# EAGLE schematic Keyboard65 (EAGLE 9.6.1)
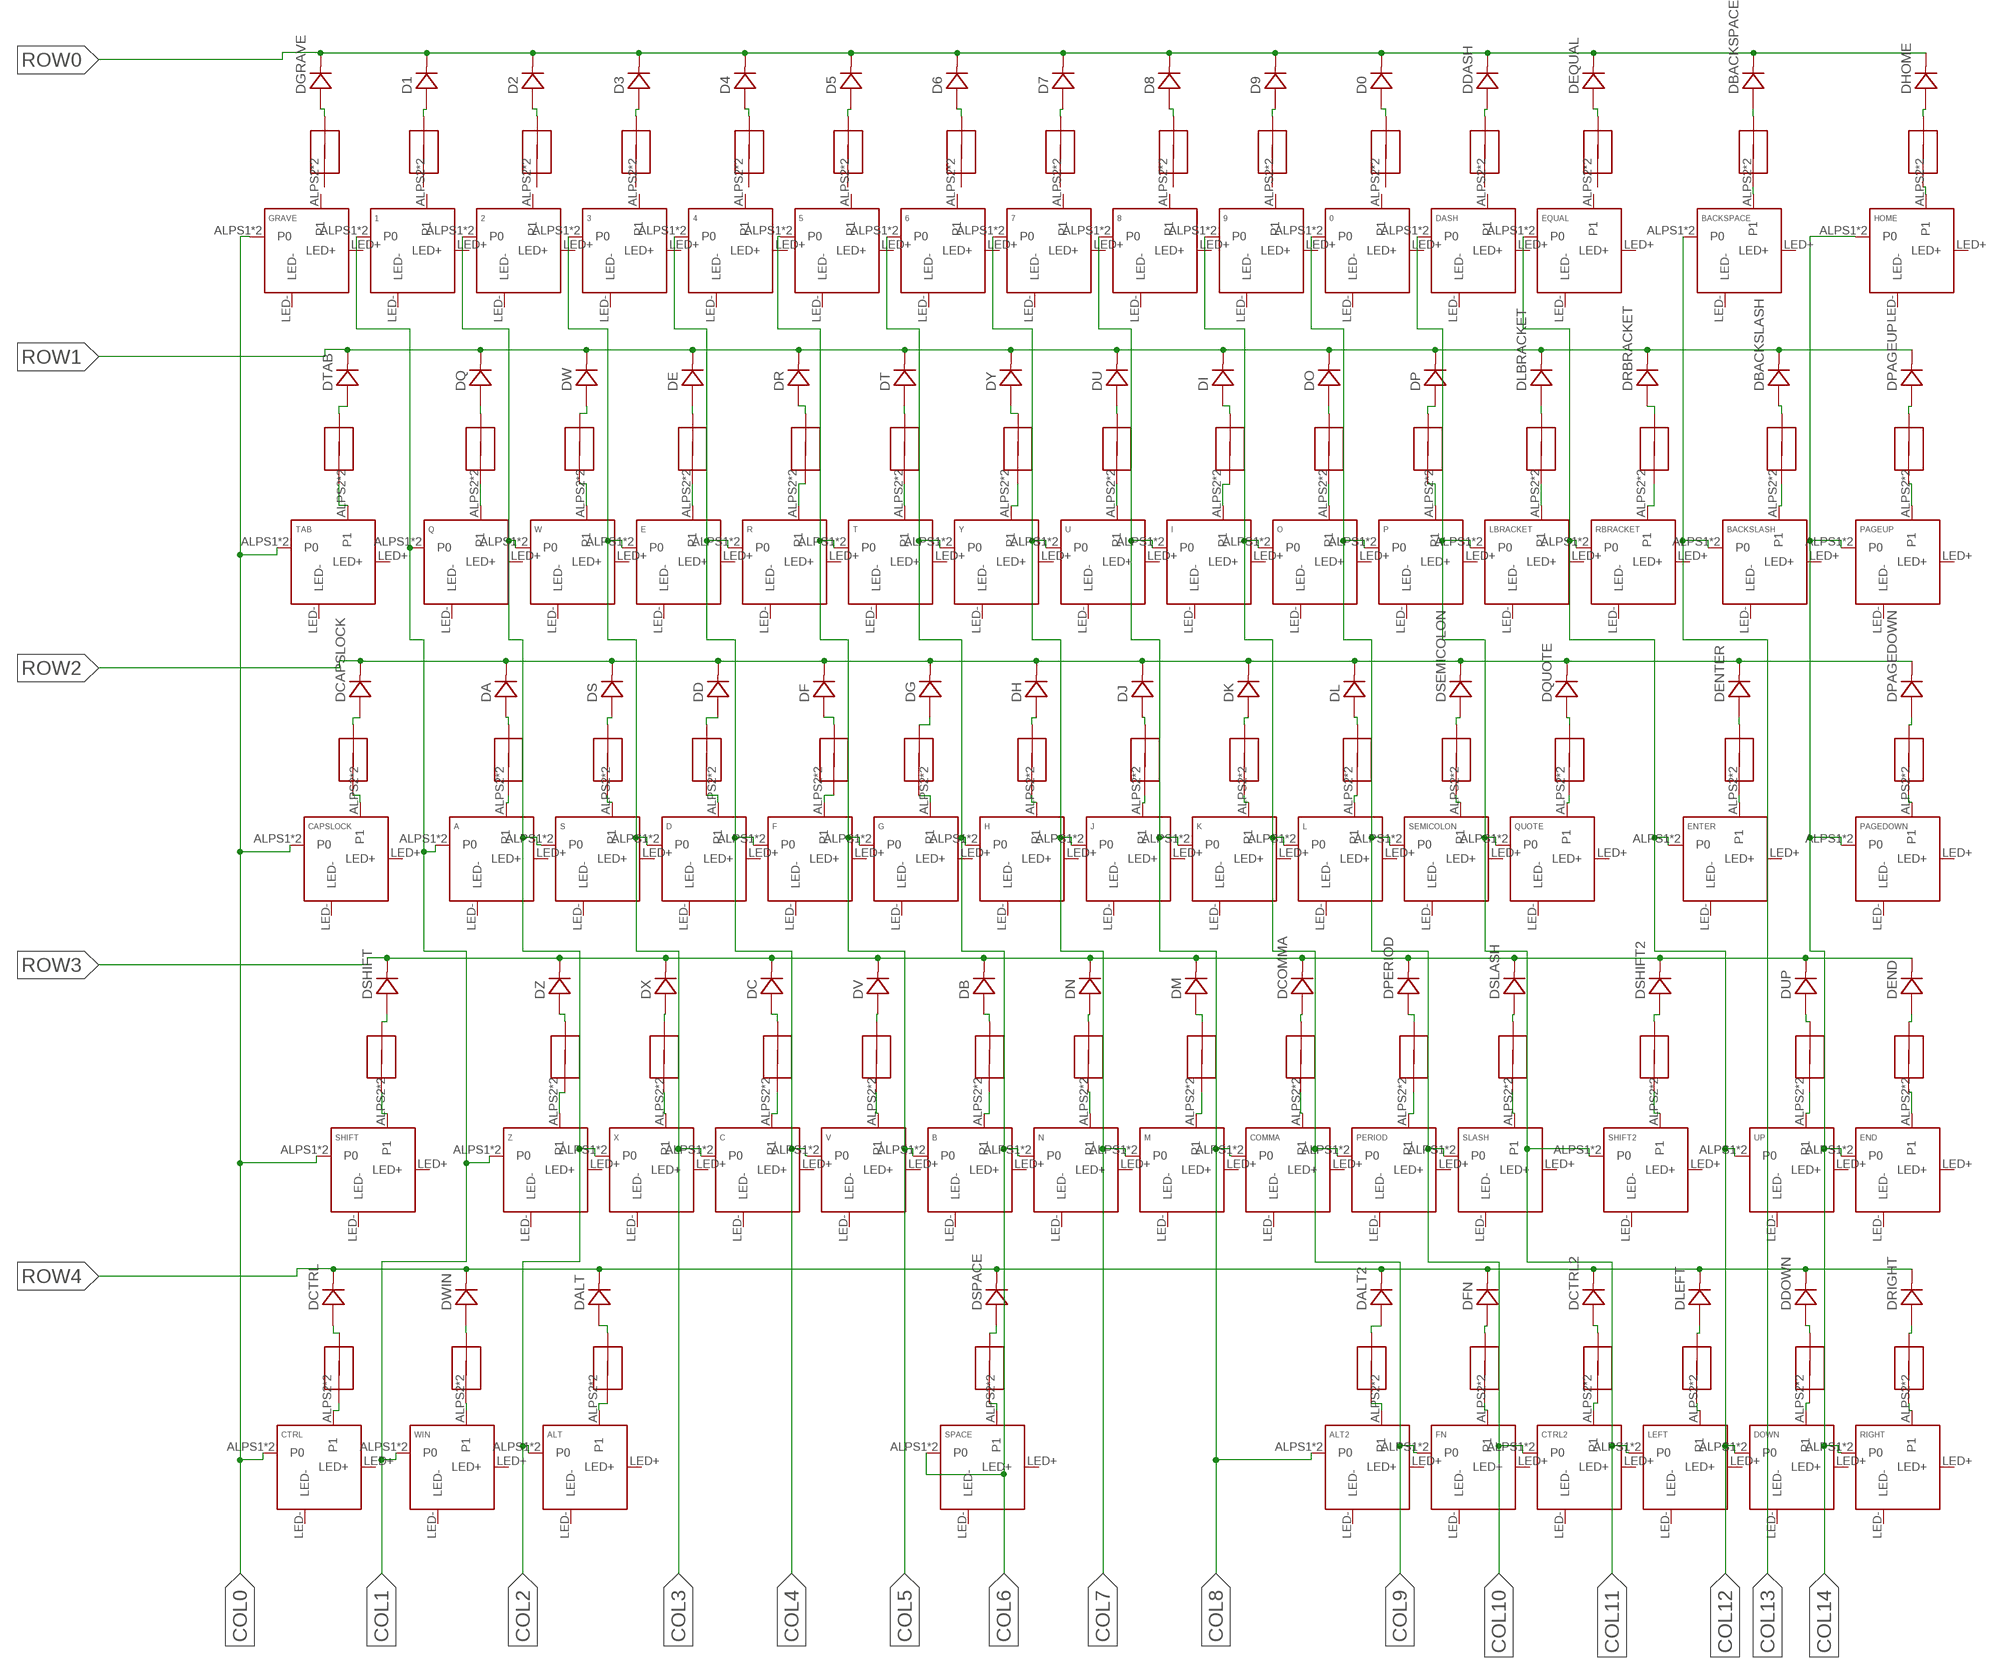
[diagram p0: schematic, sheet 1, part 1 of 2]
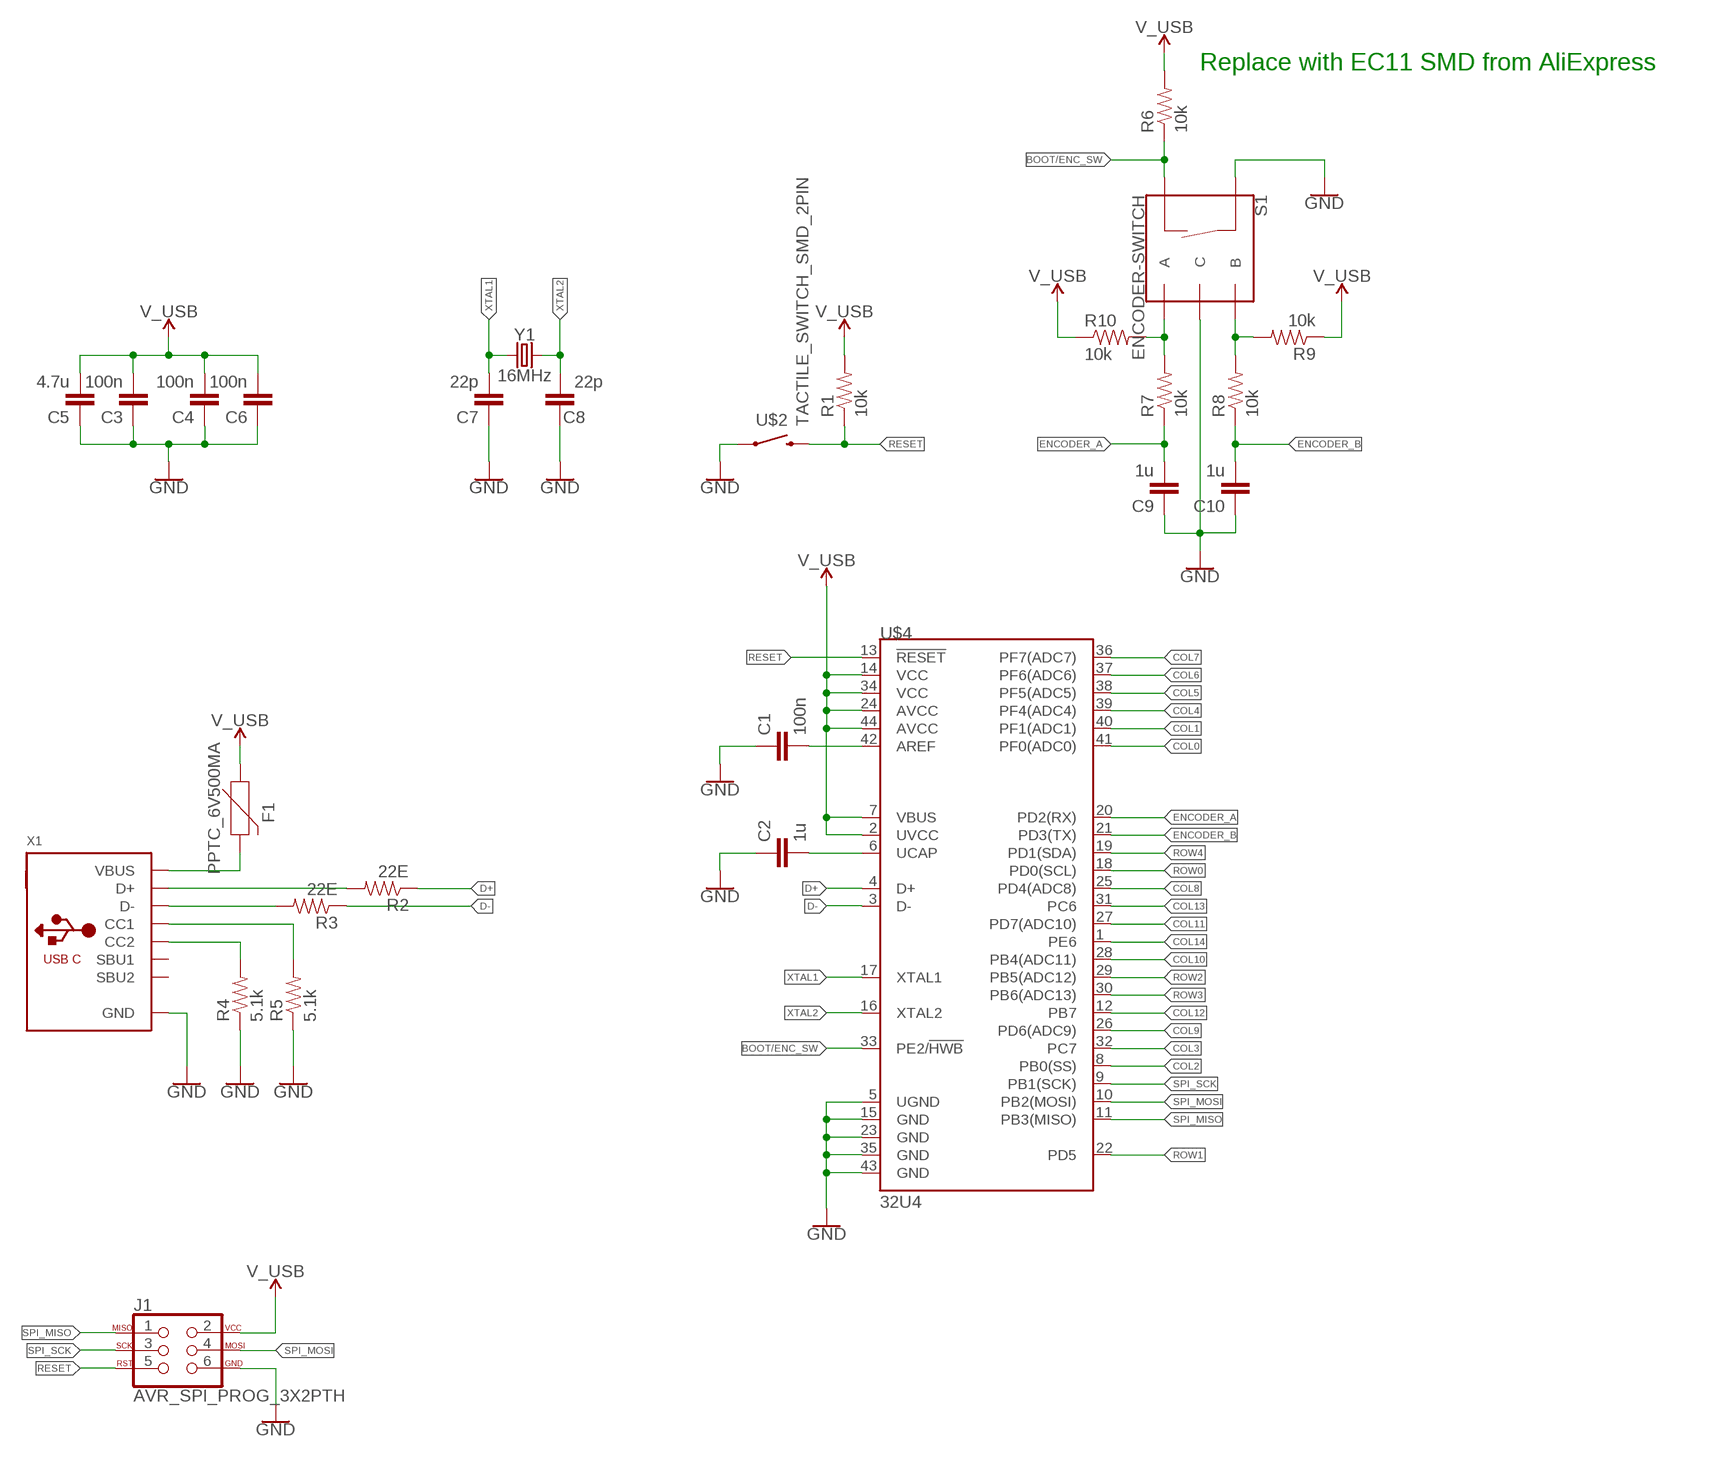
[diagram p1: schematic, sheet 1, part 2 of 2]

## Parts
0  KEYSWITCH-LED-ALPSMX-1U-LED  [ALPSMX-1U-LED]
1  KEYSWITCH-LED-ALPSMX-1U-LED  [ALPSMX-1U-LED]
2  KEYSWITCH-LED-ALPSMX-1U-LED  [ALPSMX-1U-LED]
3  KEYSWITCH-LED-ALPSMX-1U-LED  [ALPSMX-1U-LED]
4  KEYSWITCH-LED-ALPSMX-1U-LED  [ALPSMX-1U-LED]
5  KEYSWITCH-LED-ALPSMX-1U-LED  [ALPSMX-1U-LED]
6  KEYSWITCH-LED-ALPSMX-1U-LED  [ALPSMX-1U-LED]
7  KEYSWITCH-LED-ALPSMX-1U-LED  [ALPSMX-1U-LED]
8  KEYSWITCH-LED-ALPSMX-1U-LED  [ALPSMX-1U-LED]
9  KEYSWITCH-LED-ALPSMX-1U-LED  [ALPSMX-1U-LED]
A  KEYSWITCH-LED-ALPSMX-1U-LED  [ALPSMX-1U-LED]
ALT  KEYSWITCH-LED-ALPSMX-1U-LED  [ALPSMX-1U-LED]
ALT2  KEYSWITCH-LED-ALPSMX-1U-LED  [ALPSMX-1U-LED]
B  KEYSWITCH-LED-ALPSMX-1U-LED  [ALPSMX-1U-LED]
BACKSLASH  KEYSWITCH-LED-ALPSMX-1U-LED  [ALPSMX-1U-LED]
BACKSPACE  KEYSWITCH-LED-ALPSMX-2U-LED  [ALPSMX-2U-LED]
C  KEYSWITCH-LED-ALPSMX-1U-LED  [ALPSMX-1U-LED]
C1  100n  CAP0805  [0805]
C2  1u  CAP0805  [0805]
C3  100n  CAP0805  [0805]
C4  100n  CAP0805  [0805]
C5  4.7u  CAP0805  [0805]
C6  100n  CAP0805  [0805]
C7  22p  CAP0805  [0805]
C8  22p  CAP0805  [0805]
C9  1u  CAP0805  [0805]
C10  1u  CAP0805  [0805]
CAPSLOCK  KEYSWITCH-LED-ALPSMX-1U-LED  [ALPSMX-1U-LED]
COMMA  KEYSWITCH-LED-ALPSMX-1U-LED  [ALPSMX-1U-LED]
CTRL  KEYSWITCH-LED-ALPSMX-1U-LED  [ALPSMX-1U-LED]
CTRL2  KEYSWITCH-LED-ALPSMX-1U-LED  [ALPSMX-1U-LED]
D  KEYSWITCH-LED-ALPSMX-1U-LED  [ALPSMX-1U-LED]
D0  DIODE-SOD-123  [SOD-123]
D1  DIODE-SOD-123  [SOD-123]
D2  DIODE-SOD-123  [SOD-123]
D3  DIODE-SOD-123  [SOD-123]
D4  DIODE-SOD-123  [SOD-123]
D5  DIODE-SOD-123  [SOD-123]
D6  DIODE-SOD-123  [SOD-123]
D7  DIODE-SOD-123  [SOD-123]
D8  DIODE-SOD-123  [SOD-123]
D9  DIODE-SOD-123  [SOD-123]
DA  DIODE-SOD-123  [SOD-123]
DALT  DIODE-SOD-123  [SOD-123]
DALT2  DIODE-SOD-123  [SOD-123]
DASH  KEYSWITCH-LED-ALPSMX-1U-LED  [ALPSMX-1U-LED]
DB  DIODE-SOD-123  [SOD-123]
DBACKSLASH  DIODE-SOD-123  [SOD-123]
DBACKSPACE  DIODE-SOD-123  [SOD-123]
DC  DIODE-SOD-123  [SOD-123]
DCAPSLOCK  DIODE-SOD-123  [SOD-123]
DCOMMA  DIODE-SOD-123  [SOD-123]
DCTRL  DIODE-SOD-123  [SOD-123]
DCTRL2  DIODE-SOD-123  [SOD-123]
DD  DIODE-SOD-123  [SOD-123]
DDASH  DIODE-SOD-123  [SOD-123]
DDOWN  DIODE-SOD-123  [SOD-123]
DE  DIODE-SOD-123  [SOD-123]
DEND  DIODE-SOD-123  [SOD-123]
DENTER  DIODE-SOD-123  [SOD-123]
DEQUAL  DIODE-SOD-123  [SOD-123]
DF  DIODE-SOD-123  [SOD-123]
DFN  DIODE-SOD-123  [SOD-123]
DG  DIODE-SOD-123  [SOD-123]
DGRAVE  DIODE-SOD-123  [SOD-123]
DH  DIODE-SOD-123  [SOD-123]
DHOME  DIODE-SOD-123  [SOD-123]
DI  DIODE-SOD-123  [SOD-123]
DJ  DIODE-SOD-123  [SOD-123]
DK  DIODE-SOD-123  [SOD-123]
DL  DIODE-SOD-123  [SOD-123]
DLBRACKET  DIODE-SOD-123  [SOD-123]
DLEFT  DIODE-SOD-123  [SOD-123]
DM  DIODE-SOD-123  [SOD-123]
DN  DIODE-SOD-123  [SOD-123]
DO  DIODE-SOD-123  [SOD-123]
DOWN  KEYSWITCH-LED-ALPSMX-1U-LED  [ALPSMX-1U-LED]
DP  DIODE-SOD-123  [SOD-123]
DPAGEDOWN  DIODE-SOD-123  [SOD-123]
DPAGEUP  DIODE-SOD-123  [SOD-123]
DPERIOD  DIODE-SOD-123  [SOD-123]
DQ  DIODE-SOD-123  [SOD-123]
DQUOTE  DIODE-SOD-123  [SOD-123]
DR  DIODE-SOD-123  [SOD-123]
DRBRACKET  DIODE-SOD-123  [SOD-123]
DRIGHT  DIODE-SOD-123  [SOD-123]
DS  DIODE-SOD-123  [SOD-123]
DSEMICOLON  DIODE-SOD-123  [SOD-123]
DSHIFT  DIODE-SOD-123  [SOD-123]
DSHIFT2  DIODE-SOD-123  [SOD-123]
DSLASH  DIODE-SOD-123  [SOD-123]
DSPACE  DIODE-SOD-123  [SOD-123]
DT  DIODE-SOD-123  [SOD-123]
DTAB  DIODE-SOD-123  [SOD-123]
DU  DIODE-SOD-123  [SOD-123]
DUP  DIODE-SOD-123  [SOD-123]
DV  DIODE-SOD-123  [SOD-123]
DW  DIODE-SOD-123  [SOD-123]
DWIN  DIODE-SOD-123  [SOD-123]
DX  DIODE-SOD-123  [SOD-123]
DY  DIODE-SOD-123  [SOD-123]
DZ  DIODE-SOD-123  [SOD-123]
E  KEYSWITCH-LED-ALPSMX-1U-LED  [ALPSMX-1U-LED]
END  KEYSWITCH-LED-ALPSMX-1U-LED  [ALPSMX-1U-LED]
ENTER  KEYSWITCH-LED-ALPSMX-2U-LED  [ALPSMX-2U-LED]
EQUAL  KEYSWITCH-LED-ALPSMX-1U-LED  [ALPSMX-1U-LED]
F  KEYSWITCH-LED-ALPSMX-1U-LED  [ALPSMX-1U-LED]
F1  PPTC_6V500MA  [0805]
FN  KEYSWITCH-LED-ALPSMX-1U-LED  [ALPSMX-1U-LED]
G  KEYSWITCH-LED-ALPSMX-1U-LED  [ALPSMX-1U-LED]
GRAVE  KEYSWITCH-LED-ALPSMX-1U-LED  [ALPSMX-1U-LED]
H  KEYSWITCH-LED-ALPSMX-1U-LED  [ALPSMX-1U-LED]
HOME  KEYSWITCH-LED-ALPSMX-1U-LED  [ALPSMX-1U-LED]
I  KEYSWITCH-LED-ALPSMX-1U-LED  [ALPSMX-1U-LED]
J  KEYSWITCH-LED-ALPSMX-1U-LED  [ALPSMX-1U-LED]
J1  AVR_SPI_PROG_3X2PTH  [2X3]
K  KEYSWITCH-LED-ALPSMX-1U-LED  [ALPSMX-1U-LED]
L  KEYSWITCH-LED-ALPSMX-1U-LED  [ALPSMX-1U-LED]
LBRACKET  KEYSWITCH-LED-ALPSMX-1U-LED  [ALPSMX-1U-LED]
LEFT  KEYSWITCH-LED-ALPSMX-1U-LED  [ALPSMX-1U-LED]
M  KEYSWITCH-LED-ALPSMX-1U-LED  [ALPSMX-1U-LED]
N  KEYSWITCH-LED-ALPSMX-1U-LED  [ALPSMX-1U-LED]
O  KEYSWITCH-LED-ALPSMX-1U-LED  [ALPSMX-1U-LED]
P  KEYSWITCH-LED-ALPSMX-1U-LED  [ALPSMX-1U-LED]
PAGEDOWN  KEYSWITCH-LED-ALPSMX-1U-LED  [ALPSMX-1U-LED]
PAGEUP  KEYSWITCH-LED-ALPSMX-1U-LED  [ALPSMX-1U-LED]
PERIOD  KEYSWITCH-LED-ALPSMX-1U-LED  [ALPSMX-1U-LED]
Q  KEYSWITCH-LED-ALPSMX-1U-LED  [ALPSMX-1U-LED]
QUOTE  KEYSWITCH-LED-ALPSMX-1U-LED  [ALPSMX-1U-LED]
R  KEYSWITCH-LED-ALPSMX-1U-LED  [ALPSMX-1U-LED]
R1  10k  RESISTOR  [0805]
R2  22E  RESISTOR  [0805]
R3  22E  RESISTOR  [0805]
R4  5.1k  RESISTOR  [0805]
R5  5.1k  RESISTOR  [0805]
R6  10k  RESISTOR  [0805]
R7  10k  RESISTOR  [0805]
R8  10k  RESISTOR  [0805]
R9  10k  RESISTOR  [0805]
R10  10k  RESISTOR  [0805]
RBRACKET  KEYSWITCH-LED-ALPSMX-1U-LED  [ALPSMX-1U-LED]
RIGHT  KEYSWITCH-LED-ALPSMX-1U-LED  [ALPSMX-1U-LED]
S  KEYSWITCH-LED-ALPSMX-1U-LED  [ALPSMX-1U-LED]
S1  ENCODER-SWITCH  [ROTARY_ENC_PLAIN]
SEMICOLON  KEYSWITCH-LED-ALPSMX-1U-LED  [ALPSMX-1U-LED]
SHIFT  KEYSWITCH-LED-ALPSMX-2U-LED  [ALPSMX-2U-LED]
SHIFT2  KEYSWITCH-LED-ALPSMX-1U-LED  [ALPSMX-1U-LED]
SLASH  KEYSWITCH-LED-ALPSMX-1U-LED  [ALPSMX-1U-LED]
SPACE  KEYSWITCH-LED-ALPSMX-6.25U-LED  [ALPSMX-6.25U-LED]
T  KEYSWITCH-LED-ALPSMX-1U-LED  [ALPSMX-1U-LED]
TAB  KEYSWITCH-LED-ALPSMX-1U-LED  [ALPSMX-1U-LED]
U  KEYSWITCH-LED-ALPSMX-1U-LED  [ALPSMX-1U-LED]
U$1  KBD-SEPERATOR  [KBD-SEPERATOR]
U$2  TACTILE_SWITCH_SMD_2PIN  [TACTILE_SWITCH_SMD_2PIN]
U$3  KBD-SEPERATOR  [KBD-SEPERATOR]
U$4  32U4  ATMEGA32U4QFN  [QFN-44]
U$5  KBD-SEPERATOR  [KBD-SEPERATOR]
U$6  KBD-SEPERATOR  [KBD-SEPERATOR]
U$7  KBD-SEPERATOR  [KBD-SEPERATOR]
U$8  KBD-SEPERATOR  [KBD-SEPERATOR]
U$9  KBD-SEPERATOR  [KBD-SEPERATOR]
U$10  KBD-SEPERATOR  [KBD-SEPERATOR]
U$11  KBD-SEPERATOR  [KBD-SEPERATOR]
U$12  KBD-SEPERATOR  [KBD-SEPERATOR]
U$13  KBD-SEPERATOR  [KBD-SEPERATOR]
U$14  KBD-SEPERATOR  [KBD-SEPERATOR]
U$15  KBD-SEPERATOR  [KBD-SEPERATOR]
U$16  KBD-SEPERATOR  [KBD-SEPERATOR]
U$17  KBD-SEPERATOR  [KBD-SEPERATOR]
U$18  KBD-SEPERATOR  [KBD-SEPERATOR]
U$19  KBD-SEPERATOR  [KBD-SEPERATOR]
U$20  KBD-SEPERATOR  [KBD-SEPERATOR]
U$21  KBD-SEPERATOR  [KBD-SEPERATOR]
U$22  KBD-SEPERATOR  [KBD-SEPERATOR]
U$23  KBD-SEPERATOR  [KBD-SEPERATOR]
U$24  KBD-SEPERATOR  [KBD-SEPERATOR]
U$25  KBD-SEPERATOR  [KBD-SEPERATOR]
U$26  KBD-SEPERATOR  [KBD-SEPERATOR]
U$27  KBD-SEPERATOR  [KBD-SEPERATOR]
U$28  KBD-SEPERATOR  [KBD-SEPERATOR]
U$29  KBD-SEPERATOR  [KBD-SEPERATOR]
U$30  KBD-SEPERATOR  [KBD-SEPERATOR]
U$31  KBD-SEPERATOR  [KBD-SEPERATOR]
U$32  KBD-SEPERATOR  [KBD-SEPERATOR]
U$33  KBD-SEPERATOR  [KBD-SEPERATOR]
U$34  KBD-SEPERATOR  [KBD-SEPERATOR]
U$35  KBD-SEPERATOR  [KBD-SEPERATOR]
U$36  KBD-SEPERATOR  [KBD-SEPERATOR]
U$37  KBD-SEPERATOR  [KBD-SEPERATOR]
U$38  KBD-SEPERATOR  [KBD-SEPERATOR]
U$39  KBD-SEPERATOR  [KBD-SEPERATOR]
U$40  KBD-SEPERATOR  [KBD-SEPERATOR]
U$41  KBD-SEPERATOR  [KBD-SEPERATOR]
U$42  KBD-SEPERATOR  [KBD-SEPERATOR]
U$43  KBD-SEPERATOR  [KBD-SEPERATOR]
U$44  KBD-SEPERATOR  [KBD-SEPERATOR]
U$45  KBD-SEPERATOR  [KBD-SEPERATOR]
U$46  KBD-SEPERATOR  [KBD-SEPERATOR]
U$47  KBD-SEPERATOR  [KBD-SEPERATOR]
U$48  KBD-SEPERATOR  [KBD-SEPERATOR]
U$49  KBD-SEPERATOR  [KBD-SEPERATOR]
U$50  KBD-SEPERATOR  [KBD-SEPERATOR]
U$51  KBD-SEPERATOR  [KBD-SEPERATOR]
U$52  KBD-SEPERATOR  [KBD-SEPERATOR]
U$53  KBD-SEPERATOR  [KBD-SEPERATOR]
U$54  KBD-SEPERATOR  [KBD-SEPERATOR]
U$55  KBD-SEPERATOR  [KBD-SEPERATOR]
U$56  KBD-SEPERATOR  [KBD-SEPERATOR]
U$57  KBD-SEPERATOR  [KBD-SEPERATOR]
U$58  KBD-SEPERATOR  [KBD-SEPERATOR]
U$59  KBD-SEPERATOR  [KBD-SEPERATOR]
U$60  KBD-SEPERATOR  [KBD-SEPERATOR]
U$61  KBD-SEPERATOR  [KBD-SEPERATOR]
U$62  KBD-SEPERATOR  [KBD-SEPERATOR]
U$63  KBD-SEPERATOR  [KBD-SEPERATOR]
U$64  KBD-SEPERATOR  [KBD-SEPERATOR]
U$65  KBD-SEPERATOR  [KBD-SEPERATOR]
U$66  KBD-SEPERATOR  [KBD-SEPERATOR]
U$67  KBD-SEPERATOR  [KBD-SEPERATOR]
U$68  KBD-SEPERATOR  [KBD-SEPERATOR]
U$69  KBD-SEPERATOR  [KBD-SEPERATOR]
U$70  KBD-SEPERATOR  [KBD-SEPERATOR]
UP  KEYSWITCH-LED-ALPSMX-1U-LED  [ALPSMX-1U-LED]
V  KEYSWITCH-LED-ALPSMX-1U-LED  [ALPSMX-1U-LED]
W  KEYSWITCH-LED-ALPSMX-1U-LED  [ALPSMX-1U-LED]
WIN  KEYSWITCH-LED-ALPSMX-1U-LED  [ALPSMX-1U-LED]
X  KEYSWITCH-LED-ALPSMX-1U-LED  [ALPSMX-1U-LED]
X1  MICROBUILDER_USB_CUSB-C-RECEPTACLE  [MICROBUILDER_USB_C_CUSB31-CFM2AX-01-X]
Y  KEYSWITCH-LED-ALPSMX-1U-LED  [ALPSMX-1U-LED]
Y1  16MHz  CRYSTAL-16MHZSMD-5X3.2  [CRYSTAL-SMD-5X3.2-4PAD]
Z  KEYSWITCH-LED-ALPSMX-1U-LED  [ALPSMX-1U-LED]

## Nets
BOOT/ENC_SW: R6.1 S1.SW- U$4.33(PE2/!HWB)
COL0: CAPSLOCK.ALPS1(P0) CAPSLOCK.MX1(P0) CTRL.ALPS1(P0) CTRL.MX1(P0) GRAVE.ALPS1(P0) GRAVE.MX1(P0) SHIFT.ALPS1(P0) SHIFT.MX1(P0) TAB.ALPS1(P0) TAB.MX1(P0) U$4.41(PF0(ADC0))
COL1: 1.ALPS1(P0) 1.MX1(P0) A.ALPS1(P0) A.MX1(P0) Q.ALPS1(P0) Q.MX1(P0) U$4.40(PF1(ADC1)) WIN.ALPS1(P0) WIN.MX1(P0) Z.ALPS1(P0) Z.MX1(P0)
COL2: 2.ALPS1(P0) 2.MX1(P0) ALT.ALPS1(P0) ALT.MX1(P0) S.ALPS1(P0) S.MX1(P0) U$4.8(PB0(SS)) W.ALPS1(P0) W.MX1(P0) X.ALPS1(P0) X.MX1(P0)
COL3: 3.ALPS1(P0) 3.MX1(P0) C.ALPS1(P0) C.MX1(P0) D.ALPS1(P0) D.MX1(P0) E.ALPS1(P0) E.MX1(P0) U$4.32(PC7)
COL4: 4.ALPS1(P0) 4.MX1(P0) F.ALPS1(P0) F.MX1(P0) R.ALPS1(P0) R.MX1(P0) U$4.39(PF4(ADC4)) V.ALPS1(P0) V.MX1(P0)
COL5: 5.ALPS1(P0) 5.MX1(P0) B.ALPS1(P0) B.MX1(P0) G.ALPS1(P0) G.MX1(P0) T.ALPS1(P0) T.MX1(P0) U$4.38(PF5(ADC5))
COL6: 6.ALPS1(P0) 6.MX1(P0) H.ALPS1(P0) H.MX1(P0) N.ALPS1(P0) N.MX1(P0) SPACE.ALPS1(P0) SPACE.MX1(P0) U$4.37(PF6(ADC6)) Y.ALPS1(P0) Y.MX1(P0)
COL7: 7.ALPS1(P0) 7.MX1(P0) J.ALPS1(P0) J.MX1(P0) M.ALPS1(P0) M.MX1(P0) U$4.36(PF7(ADC7)) U.ALPS1(P0) U.MX1(P0)
COL8: 8.ALPS1(P0) 8.MX1(P0) ALT2.ALPS1(P0) ALT2.MX1(P0) COMMA.ALPS1(P0) COMMA.MX1(P0) I.ALPS1(P0) I.MX1(P0) K.ALPS1(P0) K.MX1(P0) U$4.25(PD4(ADC8))
COL9: 9.ALPS1(P0) 9.MX1(P0) FN.ALPS1(P0) FN.MX1(P0) L.ALPS1(P0) L.MX1(P0) O.ALPS1(P0) O.MX1(P0) PERIOD.ALPS1(P0) PERIOD.MX1(P0) U$4.26(PD6(ADC9))
COL10: 0.ALPS1(P0) 0.MX1(P0) CTRL2.ALPS1(P0) CTRL2.MX1(P0) P.ALPS1(P0) P.MX1(P0) SEMICOLON.ALPS1(P0) SEMICOLON.MX1(P0) SLASH.ALPS1(P0) SLASH.MX1(P0) U$4.28(PB4(ADC11))
COL11: DASH.ALPS1(P0) DASH.MX1(P0) LBRACKET.ALPS1(P0) LBRACKET.MX1(P0) LEFT.ALPS1(P0) LEFT.MX1(P0) QUOTE.ALPS1(P0) QUOTE.MX1(P0) SHIFT2.ALPS1(P0) SHIFT2.MX1(P0) U$4.27(PD7(ADC10))
COL12: DOWN.ALPS1(P0) DOWN.MX1(P0) ENTER.ALPS1(P0) ENTER.MX1(P0) EQUAL.ALPS1(P0) EQUAL.MX1(P0) RBRACKET.ALPS1(P0) RBRACKET.MX1(P0) U$4.12(PB7) UP.ALPS1(P0) UP.MX1(P0)
COL13: BACKSLASH.ALPS1(P0) BACKSLASH.MX1(P0) BACKSPACE.ALPS1(P0) BACKSPACE.MX1(P0) U$4.31(PC6)
COL14: END.ALPS1(P0) END.MX1(P0) HOME.ALPS1(P0) HOME.MX1(P0) PAGEDOWN.ALPS1(P0) PAGEDOWN.MX1(P0) PAGEUP.ALPS1(P0) PAGEUP.MX1(P0) RIGHT.ALPS1(P0) RIGHT.MX1(P0) U$4.1(PE6)
D+: R2.1 U$4.4(D+)
D-: R3.1 U$4.3(D-)
ENCODER_A: C9.2 R7.1 U$4.20(PD2(RX))
ENCODER_B: C10.2 R8.1 U$4.21(PD3(TX))
GND: C1.1 C2.1 C3.1 C4.1 C5.1 C6.1 C7.1 C8.1 C9.1 C10.1 J1.6 R4.1 R5.1 S1.C S1.SW+ U$2.1 U$4.5(UGND) U$4.15(GND) U$4.23(GND) U$4.35(GND) U$4.43(GND) X1.A1B12(GND) X1.B1A12(GND)
N$1: CTRL.ALPS2(P1) CTRL.MX2(P1) U$1.2
N$2: C2.2 U$4.6(UCAP)
N$3: C1.2 U$4.42(AREF)
N$4: R3.2 X1.A7(D-) X1.B7(D-)
N$5: DCTRL.A U$1.1
N$6: RIGHT.ALPS2(P1) RIGHT.MX2(P1) U$12.2
N$7: R2.2 X1.A6(D+) X1.B6(D+)
N$8: R4.2 X1.B5(CC2)
N$9: R5.2 X1.A5(CC1)
N$10: HOME.ALPS2(P1) HOME.MX2(P1) U$70.2
N$11: DHOME.A U$70.1
N$12: DBACKSPACE.A U$69.1
N$13: BACKSPACE.ALPS2(P1) BACKSPACE.MX2(P1) U$69.2
N$14: DEQUAL.A U$68.1
N$15: DDASH.A U$67.1
N$16: D0.A U$66.1
N$17: D9.A U$65.1
N$18: D8.A U$64.1
N$19: D7.A U$63.1
N$20: D6.A U$62.1
N$21: D5.A U$61.1
N$22: D4.A U$60.1
N$23: D3.A U$59.1
N$24: D2.A U$58.1
N$25: TAB.ALPS2(P1) TAB.MX2(P1) U$41.2
N$26: DTAB.A U$41.1
N$27: Q.ALPS2(P1) Q.MX2(P1) U$42.2
N$28: DQ.A U$42.1
N$29: DW.A U$43.1
N$30: U$43.2 W.ALPS2(P1) W.MX2(P1)
N$31: E.ALPS2(P1) E.MX2(P1) U$44.2
N$32: DE.A U$44.1
N$33: DR.A U$45.1
N$34: R.ALPS2(P1) R.MX2(P1) U$45.2
N$35: T.ALPS2(P1) T.MX2(P1) U$46.2
N$36: DT.A U$46.1
N$37: DY.A U$47.1
N$38: U$47.2 Y.ALPS2(P1) Y.MX2(P1)
N$39: U$48.2 U.ALPS2(P1) U.MX2(P1)
N$40: CAPSLOCK.ALPS2(P1) CAPSLOCK.MX2(P1) U$28.2
N$41: DCAPSLOCK.A U$28.1
N$42: DA.A U$27.1
N$43: A.ALPS2(P1) A.MX2(P1) U$27.2
N$44: S.ALPS2(P1) S.MX2(P1) U$29.2
N$45: DS.A U$29.1
N$46: D.ALPS2(P1) D.MX2(P1) U$30.2
N$47: DD.A U$30.1
N$48: DF.A U$31.1
N$49: F.ALPS2(P1) F.MX2(P1) U$31.2
N$50: DG.A U$32.1
N$51: G.ALPS2(P1) G.MX2(P1) U$32.2
N$52: H.ALPS2(P1) H.MX2(P1) U$33.2
N$53: DH.A U$33.1
N$54: SHIFT.ALPS2(P1) SHIFT.MX2(P1) U$13.2
N$55: DSHIFT.A U$13.1
N$56: U$14.2 Z.ALPS2(P1) Z.MX2(P1)
N$57: DZ.A U$14.1
N$58: DX.A U$15.1
N$59: U$15.2 X.ALPS2(P1) X.MX2(P1)
N$60: C.ALPS2(P1) C.MX2(P1) U$16.2
N$61: DC.A U$16.1
N$62: DV.A U$17.1
N$63: U$17.2 V.ALPS2(P1) V.MX2(P1)
N$64: B.ALPS2(P1) B.MX2(P1) U$18.2
N$65: DB.A U$18.1
N$66: N.ALPS2(P1) N.MX2(P1) U$19.2
N$67: DN.A U$19.1
N$68: DRIGHT.A U$12.1
N$69: DDOWN.A U$11.1
N$70: DOWN.ALPS2(P1) DOWN.MX2(P1) U$11.2
N$71: LEFT.ALPS2(P1) LEFT.MX2(P1) U$10.2
N$72: DLEFT.A U$10.1
N$73: DCTRL2.A U$9.1
N$74: CTRL2.ALPS2(P1) CTRL2.MX2(P1) U$9.2
N$75: FN.ALPS2(P1) FN.MX2(P1) U$8.2
N$76: DFN.A U$8.1
N$77: DALT2.A U$7.1
N$78: F1.2 X1.A4B9(VBUS) X1.B4A9(VBUS)
N$79: R8.2 R9.2 S1.B
N$80: R7.2 R10.2 S1.A
N$81: ALT2.ALPS2(P1) ALT2.MX2(P1) U$7.2
N$82: DSPACE.A U$6.1
N$83: SPACE.ALPS2(P1) SPACE.MX2(P1) U$6.2
N$84: DWIN.A U$3.1
N$85: U$3.2 WIN.ALPS2(P1) WIN.MX2(P1)
N$86: ALT.ALPS2(P1) ALT.MX2(P1) U$5.2
N$87: DALT.A U$5.1
N$88: DM.A U$20.1
N$89: M.ALPS2(P1) M.MX2(P1) U$20.2
N$90: COMMA.ALPS2(P1) COMMA.MX2(P1) U$21.2
N$91: DCOMMA.A U$21.1
N$92: DPERIOD.A U$22.1
N$93: PERIOD.ALPS2(P1) PERIOD.MX2(P1) U$22.2
N$94: SLASH.ALPS2(P1) SLASH.MX2(P1) U$23.2
N$95: DSLASH.A U$23.1
N$96: SHIFT2.ALPS2(P1) SHIFT2.MX2(P1) U$24.2
N$97: DSHIFT2.A U$24.1
N$98: U$25.2 UP.ALPS2(P1) UP.MX2(P1)
N$99: DUP.A U$25.1
N$100: DEND.A U$26.1
N$101: END.ALPS2(P1) END.MX2(P1) U$26.2
N$102: J.ALPS2(P1) J.MX2(P1) U$34.2
N$103: DJ.A U$34.1
N$104: DK.A U$35.1
N$105: K.ALPS2(P1) K.MX2(P1) U$35.2
N$106: L.ALPS2(P1) L.MX2(P1) U$36.2
N$107: DL.A U$36.1
N$108: DSEMICOLON.A U$37.1
N$109: SEMICOLON.ALPS2(P1) SEMICOLON.MX2(P1) U$37.2
N$110: QUOTE.ALPS2(P1) QUOTE.MX2(P1) U$38.2
N$111: DQUOTE.A U$38.1
N$112: ENTER.ALPS2(P1) ENTER.MX2(P1) U$39.2
N$113: DENTER.A U$39.1
N$114: DPAGEDOWN.A U$40.1
N$115: PAGEDOWN.ALPS2(P1) PAGEDOWN.MX2(P1) U$40.2
N$116: DU.A U$48.1
N$117: DI.A U$49.1
N$118: I.ALPS2(P1) I.MX2(P1) U$49.2
N$119: O.ALPS2(P1) O.MX2(P1) U$50.2
N$120: DO.A U$50.1
N$121: DP.A U$51.1
N$122: P.ALPS2(P1) P.MX2(P1) U$51.2
N$123: LBRACKET.ALPS2(P1) LBRACKET.MX2(P1) U$52.2
N$124: DLBRACKET.A U$52.1
N$125: DRBRACKET.A U$53.1
N$126: RBRACKET.ALPS2(P1) RBRACKET.MX2(P1) U$53.2
N$127: BACKSLASH.ALPS2(P1) BACKSLASH.MX2(P1) U$54.2
N$128: DBACKSLASH.A U$54.1
N$129: DPAGEUP.A U$55.1
N$130: PAGEUP.ALPS2(P1) PAGEUP.MX2(P1) U$55.2
N$131: D1.A U$57.1
N$132: DGRAVE.A U$56.1
RESET: J1.5 R1.1 U$2.2 U$4.13(!RESET)
ROW0: D0.C D1.C D2.C D3.C D4.C D5.C D6.C D7.C D8.C D9.C DBACKSPACE.C DDASH.C DEQUAL.C DGRAVE.C DHOME.C U$4.18(PD0(SCL))
ROW1: DBACKSLASH.C DE.C DI.C DLBRACKET.C DO.C DP.C DPAGEUP.C DQ.C DR.C DRBRACKET.C DT.C DTAB.C DU.C DW.C DY.C U$4.22(PD5)
ROW2: DA.C DCAPSLOCK.C DD.C DENTER.C DF.C DG.C DH.C DJ.C DK.C DL.C DPAGEDOWN.C DQUOTE.C DS.C DSEMICOLON.C U$4.29(PB5(ADC12))
ROW3: DB.C DC.C DCOMMA.C DEND.C DM.C DN.C DPERIOD.C DSHIFT2.C DSHIFT.C DSLASH.C DUP.C DV.C DX.C DZ.C U$4.30(PB6(ADC13))
ROW4: DALT2.C DALT.C DCTRL2.C DCTRL.C DDOWN.C DFN.C DLEFT.C DRIGHT.C DSPACE.C DWIN.C U$4.19(PD1(SDA))
SPI_MISO: J1.1 U$4.11(PB3(MISO))
SPI_MOSI: J1.4 U$4.10(PB2(MOSI))
SPI_SCK: J1.3 U$4.9(PB1(SCK))
V_USB: C3.2 C4.2 C5.2 C6.2 F1.1 J1.2 R1.2 R6.2 R9.1 R10.1 U$4.2(UVCC) U$4.7(VBUS) U$4.14(VCC) U$4.24(AVCC) U$4.34(VCC) U$4.44(AVCC)
XTAL1: C7.2 U$4.17(XTAL1) Y1.1
XTAL2: C8.2 U$4.16(XTAL2) Y1.3
Unconnected: 0.ALPS2(P1) 0.LED+ 0.LED- 0.MX2(P1) 1.ALPS2(P1) 1.LED+ 1.LED- 1.MX2(P1) 2.ALPS2(P1) 2.LED+ 2.LED- 2.MX2(P1) 3.ALPS2(P1) 3.LED+ 3.LED- 3.MX2(P1) 4.ALPS2(P1) 4.LED+ 4.LED- 4.MX2(P1) 5.ALPS2(P1) 5.LED+ 5.LED- 5.MX2(P1) 6.ALPS2(P1) 6.LED+ 6.LED- 6.MX2(P1) 7.ALPS2(P1) 7.LED+ 7.LED- 7.MX2(P1) 8.ALPS2(P1) 8.LED+ 8.LED- 8.MX2(P1) 9.ALPS2(P1) 9.LED+ 9.LED- 9.MX2(P1) A.LED+ A.LED- ALT2.LED+ ALT2.LED- ALT.LED+ ALT.LED- B.LED+ B.LED- BACKSLASH.LED+ BACKSLASH.LED- BACKSPACE.LED+ BACKSPACE.LED- C.LED+ C.LED- CAPSLOCK.LED+ CAPSLOCK.LED- COMMA.LED+ COMMA.LED- CTRL2.LED+ CTRL2.LED- CTRL.LED+ CTRL.LED- D.LED+ D.LED- DASH.ALPS2(P1) DASH.LED+ DASH.LED- DASH.MX2(P1) DOWN.LED+ DOWN.LED- E.LED+ E.LED- END.LED+ END.LED- ENTER.LED+ ENTER.LED- EQUAL.ALPS2(P1) EQUAL.LED+ EQUAL.LED- EQUAL.MX2(P1) F.LED+ F.LED- FN.LED+ FN.LED- G.LED+ G.LED- GRAVE.ALPS2(P1) GRAVE.LED+ GRAVE.LED- GRAVE.MX2(P1) H.LED+ H.LED- HOME.LED+ HOME.LED- I.LED+ I.LED- J.LED+ J.LED- K.LED+ K.LED- L.LED+ L.LED- LBRACKET.LED+ LBRACKET.LED- LEFT.LED+ LEFT.LED- M.LED+ M.LED- N.LED+ N.LED- O.LED+ O.LED- P.LED+ P.LED- PAGEDOWN.LED+ PAGEDOWN.LED- PAGEUP.LED+ PAGEUP.LED- PERIOD.LED+ PERIOD.LED- Q.LED+ Q.LED- QUOTE.LED+ QUOTE.LED- R.LED+ R.LED- RBRACKET.LED+ RBRACKET.LED- RIGHT.LED+ RIGHT.LED- S.LED+ S.LED- SEMICOLON.LED+ SEMICOLON.LED- SHIFT2.LED+ SHIFT2.LED- SHIFT.LED+ SHIFT.LED- SLASH.LED+ SLASH.LED- SPACE.LED+ SPACE.LED- T.LED+ T.LED- TAB.LED+ TAB.LED- U$56.2 U$57.2 U$58.2 U$59.2 U$60.2 U$61.2 U$62.2 U$63.2 U$64.2 U$65.2 U$66.2 U$67.2 U$68.2 U.LED+ U.LED- UP.LED+ UP.LED- V.LED+ V.LED- W.LED+ W.LED- WIN.LED+ WIN.LED- X1.A8(SBU1) X1.B8(SBU2) X.LED+ X.LED- Y.LED+ Y.LED- Z.LED+ Z.LED-

## Notes on the sheet
- Replace with EC11 SMD from AliExpress

## Library data of the parts
0 1-9 A ALT ALT2 B BACKSLASH BACKSPACE C CAPSLOCK COMMA CTRL CTRL2 D DASH DOWN E END ENTER EQUAL F FN G GRAVE H HOME I J K L LBRACKET LEFT M N O P PAGEDOWN PAGEUP PERIOD Q QUOTE R RBRACKET RIGHT S SEMICOLON SHIFT SHIFT2 SLASH SPACE T TAB U UP V W WIN X Y Z = Keyboard:KEYSWITCH-LED
C1-C10 = SparkFun:CAP: Capacitor Standard 0603 ceramic capacitor, and 0.1" leaded capacitor.
D0 D1-D9 DA DALT DALT2 DB DBACKSLASH DBACKSPACE DC DCAPSLOCK DCOMMA DCTRL DCTRL2 DD DDASH DDOWN DE DEND DENTER DEQUAL DF DFN DG DGRAVE DH DHOME DI DJ DK DL DLBRACKET DLEFT DM DN DO DP DPAGEDOWN DPAGEUP DPERIOD DQ DQUOTE DR DRBRACKET DRIGHT DS DSEMICOLON DSHIFT DSHIFT2 DSLASH DSPACE DT DTAB DU DUP DV DW DWIN DX DY DZ = Components:DIODE: Standard 1N4148 diode
F1 = SparkFun-Fuses:PPTC: Resettable Fuse PPTC Resettable Fuse. Really a sort of resistor with a polymeric positive temperature coefficient whose resistance increases dramatically with an increase in temperature. When heated by the power passing through the resistance rises causing the current to be limited, protecting the circuit. This is achieved by the transition of the polymer from a crystalline to an amorphous state where the conductive carbon separates breaking the conductive pathways found in the cool crystalline structure. When a PPTC cools back down it resumes conducting letting the circuit turn back on. SparkFun Products: SparkFun RedBoard - Programmed with Arduino <https://www.sparkfun.com/products/12757> Pro Micro - 5V/16MHz <https://www.sparkfun.com/products/12640> Arduino Pro 328 - 5V/16MHz <https://www.sparkfun.com/products/10915> MP3 Trigger <https://www.sparkfun.com/products/13720>
J1 = SparkFun-Connectors:AVR_SPI_PROG_3X2: AVR ISP 6 Pin This is the reduced ISP connector for AVR programming. Common on Arduino. This footprint will take up less PCB space and can be used with a 10-pin to 6-pin adapter such as SKU: BOB-08508 **Special note about "TEST_POINT" package. The stop mask is on the top side, so if you want your programming test points to be on the bottom of your board, make sure to place this package on the bottom side of the board. This also ensure that the orientation to program from the bottom side will be correct. SparkFun Products: SparkFun ISP Pogo Adapter <https://www.sparkfun.com/products/11591> - NS Tiny AVR Programmer <https://www.sparkfun.com/products/11801> -PTH
R1-R10 = SparkFun:RESISTOR: Resistor Basic schematic elements and footprints for 0603, 1206, and PTH 1/10th watt (small) resistors.
S1 = SparkFun-Switches:ENCODER-SWITCH: Rotary Encoder w/ Select Switch Encoders rotate similarly to potentiometers, but they’re different from potentiometers in that an encoder has full rotation without limits. They output gray code so that you can tell how much and in which direction the encoder has been turned. This encoder includes a push-down select switch built into the shaft. SparkFun Products Rotary Encoder <https://www.sparkfun.com/products/9117> (COM-09117); SF_SKU: COM-09117
U$1 U$3 U$5-U$70 = other_parts:KBD-SEPERATOR
U$2 = other_parts:TACTILE_SWITCH_SMD_2PIN
U$4 = SparkFun-IC-Microcontroller:ATMEGA32U4: Atmel MCU, 32KByte Atmel 44-pin 8-bit Microcontroller with 32KBytes of ISP Flash and USB Controller Datasheet <http://cdn.sparkfun.com/datasheets/Dev/Arduino/Boards/ATMega32U4.pdf> SparkFun Products LilyPad Arduino USB - ATmega32U4 Board <https://www.sparkfun.com/products/12049> (DEV-12049) Pro Micro - 5V/16MHz <https://www.sparkfun.com/products/12640> (DEV-12640) Pro Micro - 3.3V/8MHz <https://www.sparkfun.com/products/12587> (DEV-12587) Fio v3 - ATmega32U4 <https://www.sparkfun.com/products/11520> (DEV-11520) Qduino Mini <https://www.sparkfun.com/products/13614> (DEV-13614) Makey Makey - Standard Kit <https://www.sparkfun.com/products/11511> (WIG-11511) Makey Makey Deluxe Kit <https://www.sparkfun.com/products/11519> (WIG-11519); PROD_ID: IC-10828
X1 = Adafruit USB Type C:MICROBUILDER_USB_C: USB Type-C USB 2.0 Connector
Y1 = SparkFun-Clocks:CRYSTAL-16MHZ: 16MHz Crystal Digikey Example <http://www.digikey.com/product-search/en?keywords=535-9122-1-ND> Frequency: 16MHz Frequency Stability: ±50ppm Frequency Tolerance: ±20ppm Load Capacitance: 18pF SparkFun Products: Pro Micro -5V/16MHz <https://www.sparkfun.com/products/12640> SparkFun Serial Enabled LCD Kit <https://www.sparkfun.com/products/10097>; PROD_ID: XTAL-08218; SF_ID: COM-00094